# Altium schematic sheet MCU.SchDoc
size A4
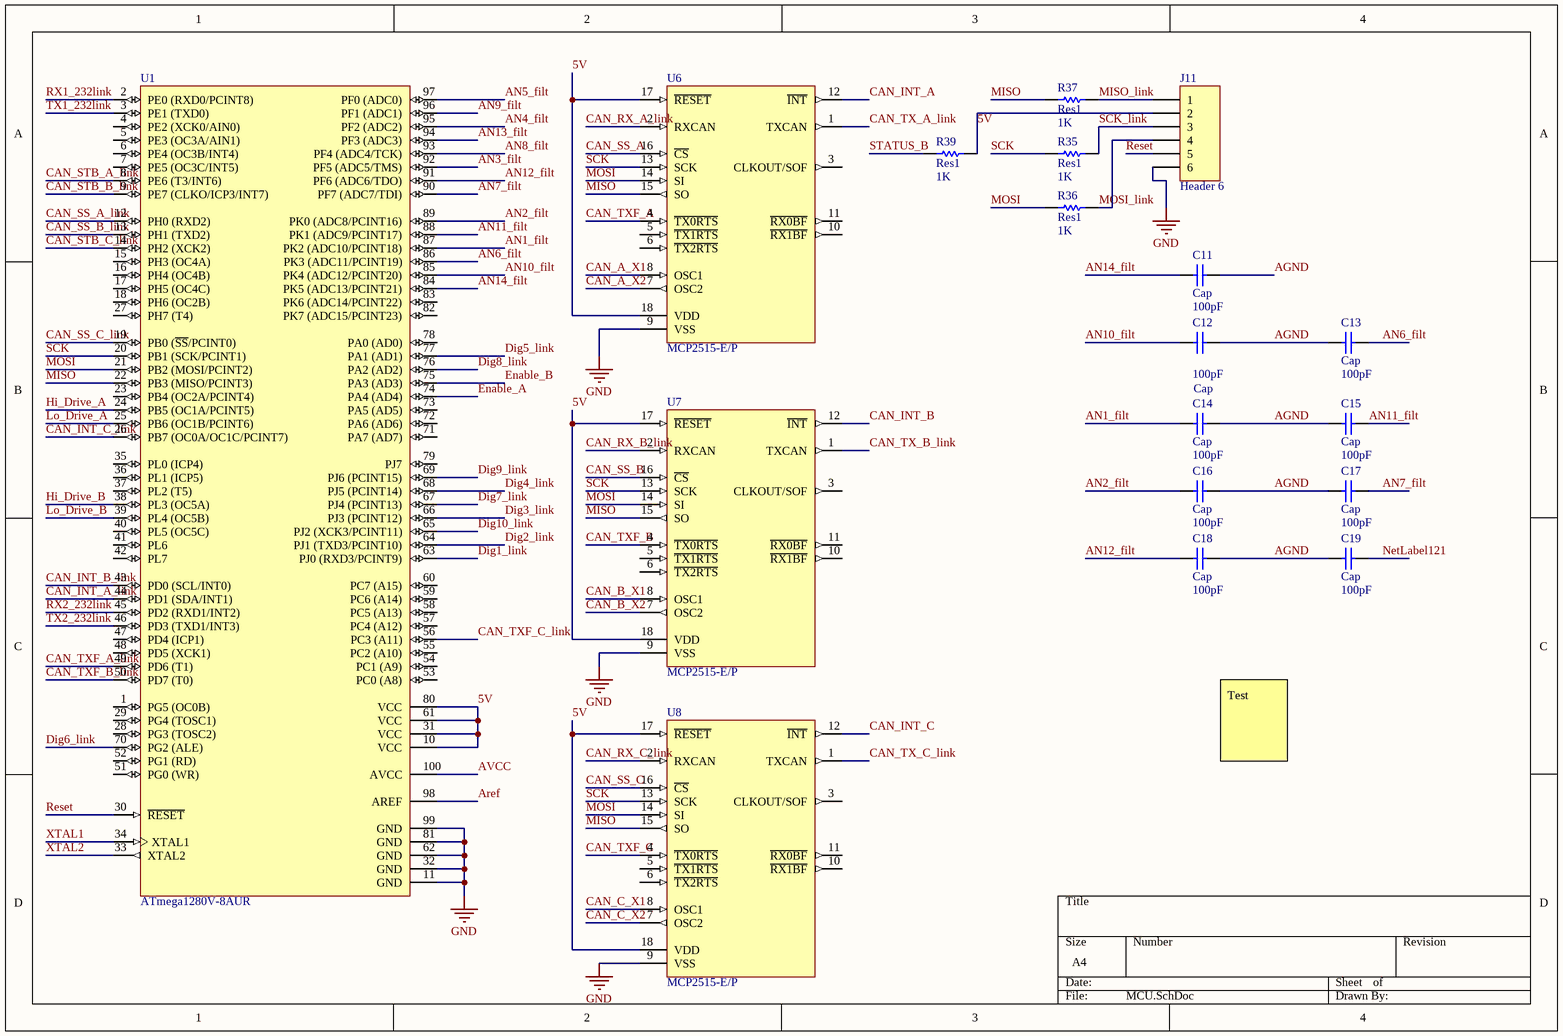
[diagram p0: MCU.SchDoc]

## Parts
C11  Cap  value 100pF  [RAD-0.3]
C12  Cap  value 100pF  [RAD-0.3]
C13  Cap  value 100pF  [RAD-0.3]
C14  Cap  value 100pF  [RAD-0.3]
C15  Cap  value 100pF  [RAD-0.3]
C16  Cap  value 100pF  [RAD-0.3]
C17  Cap  value 100pF  [RAD-0.3]
C18  Cap  value 100pF  [RAD-0.3]
C19  Cap  value 100pF  [RAD-0.3]
J11  Header 6  [HDR1X6]
R35  Res1  value 1K  [AXIAL-0.3]
R36  Res1  value 1K  [AXIAL-0.3]
R37  Res1  value 1K  [AXIAL-0.3]
R39  Res1  value 1K  [AXIAL-0.3]
U1  ATmega1280V-8AUR  [100A_M]
U6  MCP2515-E/P  [PDIP300-P18]
U7  MCP2515-E/P  [PDIP300-P18]
U8  MCP2515-E/P  [PDIP300-P18]

## Nets
GND: J11.6 U1.11(GND) U1.32(GND) U1.62(GND) U1.81(GND) U1.99(GND) U6.9(VSS) U7.9(VSS) U8.9(VSS)
5V: J11.2 R39.2 U1.10(VCC) U1.31(VCC) U1.61(VCC) U1.80(VCC) U6.17(~{RESET}) U6.18(VDD) U7.17(~{RESET}) U7.18(VDD) U8.17(~{RESET}) U8.18(VDD)
AGND: C11.2 C12.2 C13.1 C14.2 C15.1 C16.2 C17.1 C18.2 C19.1
AN1_filt: C14.1 U1.87(PK2_(ADC10/PCINT18))
AN2_filt: C16.1 U1.89(PK0_(ADC8/PCINT16))
AN3_filt: U1.92(PF5_(ADC5/TMS))
AN4_filt: U1.95(PF2_(ADC2))
AN5_filt: U1.97(PF0_(ADC0))
AN6_filt: C13.2 U1.86(PK3_(ADC11/PCINT19))
AN7_filt: C17.2 U1.90(PF7_(ADC7/TDI))
AN8_filt: U1.93(PF4_(ADC4/TCK))
AN9_filt: U1.96(PF1_(ADC1))
AN10_filt: C12.1 U1.85(PK4_(ADC12/PCINT20))
AN11_filt: C15.2 U1.88(PK1_(ADC9/PCINT17))
AN12_filt: C18.1 U1.91(PF6_(ADC6/TDO))
AN13_filt: U1.94(PF3_(ADC3))
AN14_filt: C11.1 U1.84(PK5_(ADC13/PCINT21))
Aref: U1.98(AREF)
AVCC: U1.100(AVCC)
CAN_A_X1: U6.8(OSC1)
CAN_A_X2: U6.7(OSC2)
CAN_B_X1: U7.8(OSC1)
CAN_B_X2: U7.7(OSC2)
CAN_C_X1: U8.8(OSC1)
CAN_C_X2: U8.7(OSC2)
CAN_INT_A: U6.12(~{INT})
CAN_INT_A_link: U1.44(PD1_(SDA/INT1))
CAN_INT_B: U7.12(~{INT})
CAN_INT_B_link: U1.43(PD0_(SCL/INT0))
CAN_INT_C: U8.12(~{INT})
CAN_INT_C_link: U1.26(PB7_(OC0A/OC1C/PCINT7))
CAN_RX_A_link: U6.2(RXCAN)
CAN_RX_B_link: U7.2(RXCAN)
CAN_RX_C_link: U8.2(RXCAN)
CAN_SS_A: U6.16(~{CS})
CAN_SS_A_link: U1.12(PH0_(RXD2))
CAN_SS_B: U7.16(~{CS})
CAN_SS_B_link: U1.13(PH1_(TXD2))
CAN_SS_C: U8.16(~{CS})
CAN_SS_C_link: U1.19(PB0_(~{SS}/PCINT0))
CAN_STB_A_link: U1.8(PE6_(T3/INT6))
CAN_STB_B_link: U1.9(PE7_(CLKO/ICP3/INT7))
CAN_STB_C_link: U1.14(PH2_(XCK2))
CAN_TX_A_link: U6.1(TXCAN)
CAN_TX_B_link: U7.1(TXCAN)
CAN_TX_C_link: U8.1(TXCAN)
CAN_TXF_A: U6.4(~{TX0RTS})
CAN_TXF_A_link: U1.49(PD6_(T1))
CAN_TXF_B: U7.4(~{TX0RTS})
CAN_TXF_B_link: U1.50(PD7_(T0))
CAN_TXF_C: U8.4(~{TX0RTS})
CAN_TXF_C_link: U1.56(PC3_(A11))
Dig1_link: U1.63(PJ0_(RXD3/PCINT9))
Dig2_link: U1.64(PJ1_(TXD3/PCINT10))
Dig3_link: U1.66(PJ3_(PCINT12))
Dig4_link: U1.68(PJ5_(PCINT14))
Dig5_link: U1.77(PA1_(AD1))
Dig6_link: U1.70(PG2_(ALE))
Dig7_link: U1.67(PJ4_(PCINT13))
Dig8_link: U1.76(PA2_(AD2))
Dig9_link: U1.69(PJ6_(PCINT15))
Dig10_link: U1.65(PJ2_(XCK3/PCINT11))
Enable_A: U1.74(PA4_(AD4))
Enable_B: U1.75(PA3_(AD3))
Hi_Drive_A: U1.24(PB5_(OC1A/PCINT5))
Hi_Drive_B: U1.38(PL3_(OC5A))
Lo_Drive_A: U1.25(PB6_(OC1B/PCINT6))
Lo_Drive_B: U1.39(PL4_(OC5B))
MISO: R37.1 U1.22(PB3_(MISO/PCINT3)) U6.15(SO) U7.15(SO) U8.15(SO)
MISO_link: J11.1 R37.2
MOSI: R36.1 U1.21(PB2_(MOSI/PCINT2)) U6.14(SI) U7.14(SI) U8.14(SI)
MOSI_link: J11.4 R36.2
NetLabel121: C19.2
Reset: J11.5 U1.30(~{RESET})
RX1_232link: U1.2(PE0_(RXD0/PCINT8))
RX2_232link: U1.45(PD2_(RXD1/INT2))
SCK: R35.1 U1.20(PB1_(SCK/PCINT1)) U6.13(SCK) U7.13(SCK) U8.13(SCK)
SCK_link: J11.3 R35.2
STATUS_B: R39.1
TX1_232link: U1.3(PE1_(TXD0))
TX2_232link: U1.46(PD3_(TXD1/INT3))
XTAL1: U1.34(XTAL1)
XTAL2: U1.33(XTAL2)

Not connected (* = marked no-connect by the designer): U1 1(PG5_(OC0B)) 4(PE2_(XCK0/AIN0)) 5(PE3_(OC3A/AIN1)) 6(PE4_(OC3B/INT4)) 7(PE5_(OC3C/INT5)) 15(PH3_(OC4A)) 16(PH4_(OC4B)) 17(PH5_(OC4C)) 18(PH6_(OC2B)) 23(PB4_(OC2A/PCINT4)) 27(PH7_(T4)) 28(PG3_(TOSC2)) 29(PG4_(TOSC1)) 35(PL0_(ICP4)) 36(PL1_(ICP5)) 37(PL2_(T5)) 40(PL5_(OC5C)) 41(PL6) 42(PL7) 47(PD4_(ICP1)) 48(PD5_(XCK1)) 51(PG0_(WR)) 52(PG1_(RD)) 53(PC0_(A8)) 54(PC1_(A9)) 55(PC2_(A10)) 57(PC4_(A12)) 58(PC5_(A13)) 59(PC6_(A14)) 60(PC7_(A15)) 71(PA7_(AD7)) 72(PA6_(AD6)) 73(PA5_(AD5)) 78(PA0_(AD0)) 79(PJ7) 82(PK7_(ADC15/PCINT23)) 83(PK6_(ADC14/PCINT22)); U6 3(CLKOUT/SOF) 5(~{TX1RTS}) 6(~{TX2RTS}) 10(~{RX1BF}) 11(~{RX0BF}); U7 3(CLKOUT/SOF) 5(~{TX1RTS}) 6(~{TX2RTS}) 10(~{RX1BF}) 11(~{RX0BF}); U8 3(CLKOUT/SOF) 5(~{TX1RTS}) 6(~{TX2RTS}) 10(~{RX1BF}) 11(~{RX0BF})

## Notes on the sheet
- Test

## Library data of the parts
C11-C19 = Cap: Capacitor; Published: 8-Jun-2000; LatestRevisionDate: 17-Jul-2002; LatestRevisionNote: Re-released for DXP Platform.; PackageReference: RAD-0.3; Publisher: Altium Limited; PackageDescription: Radial Cap, Thru-Hole; 2 Leads; 0.3 in Pin Spacing
J11 = Header 6: Header, 6-Pin; LatestRevisionDate: 17-Jul-2002; LatestRevisionNote: Re-released for DXP Platform.; Publisher: Altium Limited
R35-R37 R39 = Res1: Resistor; Published: 8-Jun-2000; LatestRevisionDate: 17-Jul-2002; LatestRevisionNote: Re-released for DXP Platform.; PackageReference: AXIAL-0.3; Publisher: Altium Limited; PackageDescription: Axial Device, Thru-Hole; 2 Leads; 0.3 in Pin Spacing
U1 = CMP-0095-00520-1: 8-bit AVR Microcontroller, 1.8-5.5V, 4MHz, 128KB Flash, 4KB EEPROM, 8KB SRAM, 86 GPIO pins, 100-pin TQFP, Industrial Grade (-40°C to 85°C), Pb-Free, Reel; Code_JEDEC: MS-026-AED; ComponentLink2Description: ATmega640/1280/1281/2560/2561 Datasheet; ComponentLink3URL: http://www.atmel.com/dyn/resources/prod_documents/2549S.pdf; PackageVersion: revD, Oct-2010; PackageReference: 100A; ComponentLink1Description: Manufacturer URL; DatasheetVersion: revN, May-2011; PackageDescription: 100-Pin Thin Profile Plastic Quad Flat Pack (TQFP), 14 x 14 x 1.0 mm Body, 0.5 mm Pitch; ComponentLink1URL: http://www.atmel.com/; ComponentLink2URL: http://www.atmel.com/dyn/resources/prod_documents/doc2549.pdf; ComponentLink3Description: ATmega640/1280/1281/2560/2561 Summary
U6-U8 = CMP-0186-00008-2: Stand-Alone CAN Controller With SPI Interface, 18-Pin PDIP, Extended Temperature; RevisionNote: URLs added. DatasheetVersion updated.; PackageReference: PDIP300-P18; ComponentLink1Description: Manufacturer URL; ComponentLink1URL: http://www.microchip.com/; Code_JEDEC: MS-001; ComponentLink3URL: http://www.microchip.com/stellent/groups/techpub_sg/documents/packagingspec/en012702.pdf; ComponentLink2Description: Datasheet; PackageDescription: 18-Lead Plastic Dual In-Line (P) - 300 mil Body [PDIP]; ComponentLink3Description: Package Specification; PackageVersion: revBB, Aug-2009; ComponentLink2URL: http://ww1.microchip.com/downloads/en/DeviceDoc/21801f.pdf; DatasheetVersion: revF, Oct-2010